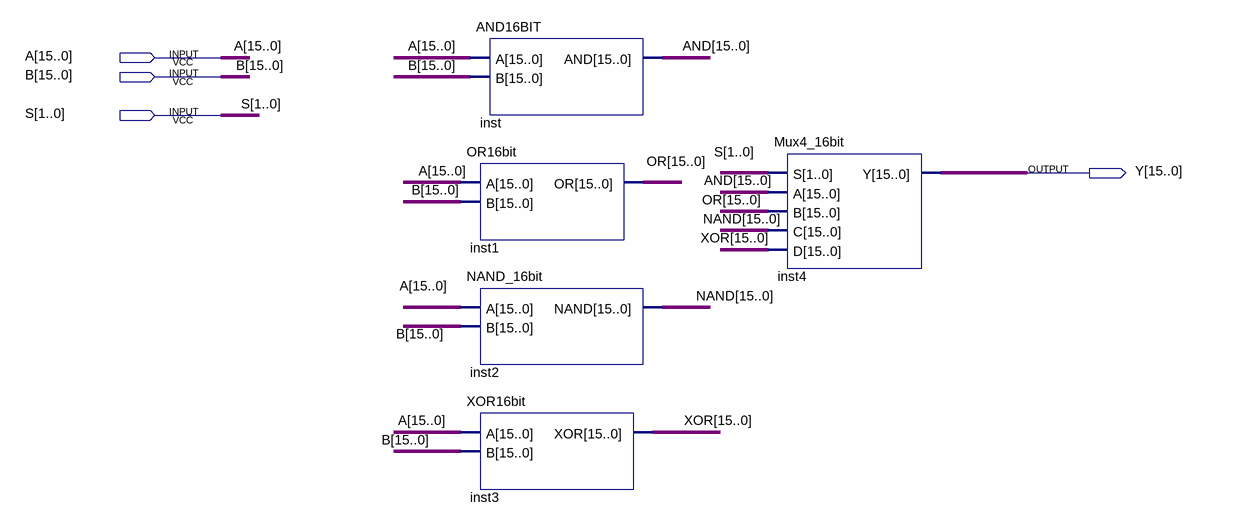
[diagram p0: schematic sheet]
// Quartus schematic LU_16bit.bdf as structural Verilog: 5 symbols, 4 pins
module LU_16bit (
  input  [15:0] A,
  input  [15:0] B,
  input  [1:0] S,
  output [15:0] Y
);

  wire [15:0] AND, NAND, OR, XOR;

  AND16BIT inst (.A(A), .B(B), .AND(AND));
  OR16bit inst1 (.A(A), .B(B), .OR(OR));
  NAND_16bit inst2 (.A(A), .B(B), .NAND(NAND));
  XOR16bit inst3 (.A(A), .B(B), .XOR(XOR));
  Mux4_16bit inst4 (.S(S), .A(AND), .B(OR), .C(NAND), .D(XOR), .Y(Y));
endmodule
